# EAGLE schematic Timer Autoradio NE555+CD4011 (EAGLE 6.4)
Circuito per mantenere l'autoradio acceso per ancora 15 minuti dopo aver spento la macchina.
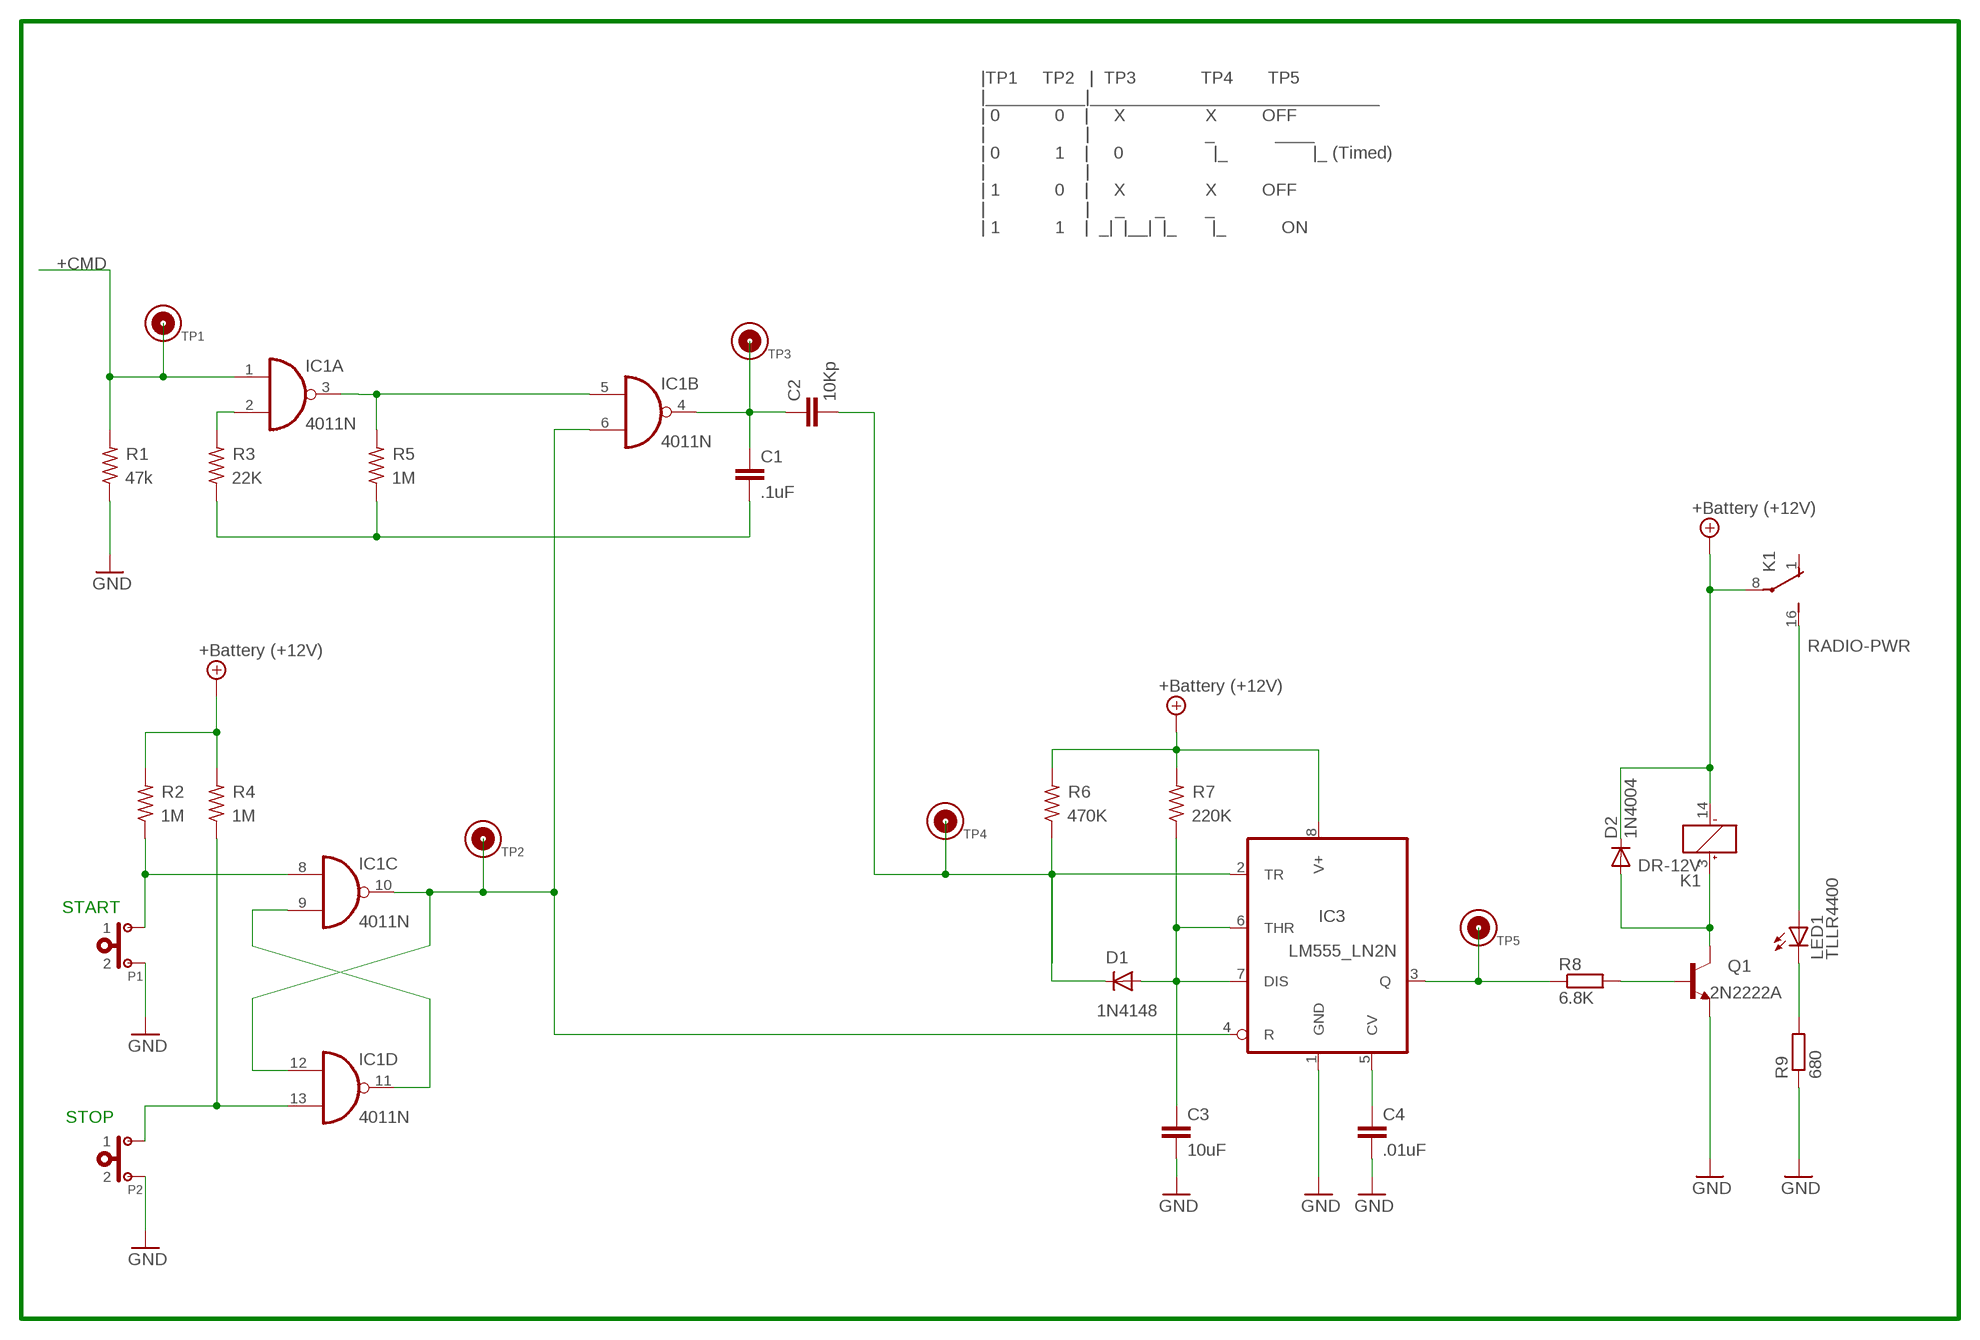
[diagram p0: schematic, sheet 1]

## Parts
C1  .1uF  C-EU025-040X050  [C025-040X050]
C2  10Kp  C-EU025-040X050  [C025-040X050]
C3  10uF  C-EU025-040X050  [C025-040X050]
C4  .01uF  C-EU025-040X050  [C025-040X050]
D1  1N4148  1N4148DO35-10  [DO35-10]
D2  1N4004  [DO41-10]
IC1  4011N  [DIL14]
IC3  LM555_LN2N  [DIL08]
K1  DR-12V  [DR-1]
LED1  TLLR4400  [LED3MM]
P1  PULSANTENO  [SIP02]
P2  PULSANTENO  [SIP02]
Q1  2N2222A  [TO18]
R1  47k  R-US_0207/12  [0207/12]
R2  1M  R-US_0207/12  [0207/12]
R3  22K  R-US_0207/12  [0207/12]
R4  1M  R-US_0207/12  [0207/12]
R5  1M  R-US_0207/12  [0207/12]
R6  470K  R-US_0207/12  [0207/12]
R7  220K  R-US_0207/12  [0207/12]
R8  6.8K  R-EU_0207/10  [0207/10]
R9  680  R-EU_0207/10  [0207/10]
TP1  SIP01  [SIP01]
TP2  SIP01  [SIP01]
TP3  SIP01  [SIP01]
TP4  SIP01  [SIP01]
TP5  SIP01  [SIP01]

## Nets
+12V: D2.C IC3.8(V+) K1.8(-2:P) K1.14(-1:-) R2.2 R4.2 R6.2 R7.2 ; supply symbol labelled +Battery (+12V)
+CMD: IC1.1(A:I0) R1.2 TP1.P$1(TP)
GND: C3.2 C4.2 IC3.1(GND) P1.2 P2.2 Q1.1(E) R1.1 R9.1
N$1: C1.2 R3.1 R5.1
N$2: Q1.2(B) R8.2
N$3: D2.A K1.3(-1:+) Q1.3(C)
N$4: C4.1 IC3.5(CV)
N$5: IC1.3(A:O) IC1.5(B:I0) R5.2
N$6: C1.1 C2.1 IC1.4(B:O) TP3.P$1(TP)
N$7: IC1.2(A:I1) R3.2
N$8: LED1.K(C) R9.2
N$9: IC1.8(C:I0) P1.1 R2.1
N$11: IC3.3(Q) R8.1 TP5.P$1(TP)
N$12: IC1.6(B:I1) IC1.10(C:O) IC1.12(D:I0) IC3.4(R) TP2.P$1(TP)
N$13: IC1.9(C:I1) IC1.11(D:O)
N$14: C2.2 D1.C IC3.2(TR) R6.1 TP4.P$1(TP)
N$15: IC1.13(D:I1) P2.1 R4.1
N$18: C3.1 D1.A IC3.6(THR) IC3.7(DIS) R7.1
RADIO-PWR: K1.16(-2:S) LED1.A
Unconnected: K1.1(-2:O)

## Notes on the sheet
- |TP1     TP2   |  TP3             TP4       TP5
  |__________|_____________________________
  | 0           0    |     X                X         OFF
  |                    |                       _            ____
  | 0           1    |     0                  |_                 |_ (Timed) 
  |                    |
  | 1           0    |     X                X         OFF
  |                    |     _      _        _
  | 1           1    |  _|  |__|  |_       |_           ON
- START
- STOP

## Power pins joined to a net without a drawn wire
VDD: IC1.14(P:VDD)
VSS: IC1.7(P:VSS)

## Library data of the parts
C1-C4 = Ln-RCL:C-EU: CAPACITOR, European symbol
D1 = diode:1N4148: DIODE high speed (Philips)
D2 = diode:1N4004: DIODE general purpose rectifier, 1 A
IC1 = Ln-40xx:4011: Quad 2-input NAND
IC3 = Ln-linear:*555_LN2: TIMER
K1 = relay:DR-*V: HIGHLY RELIABLE MINIATURE DIP RELAYS NAiS Source: www.mew-europe.com/ac/download/ datasheet/relay/dr_en.pdf; MPN: DR-12V; OC_FARNELL: 1124066; OC_NEWARK: 91K6794
LED1 = Loreto:TLLR4400: Low Current (2mA) LED 3 mm Tinted Diffused Package color RED Source: Data sheet <http://www.farnell.com/datasheets/391100.pdf>; MF: VISHAY SEMICONDUCTOR; OC_FARNELL: 1612437
P1 P2 = Ln-Varie:PULSANTENO: Pulsante NO
Q1 = transistor-npn:2N2222*: NPN Transistor
R1-R7 = rcl:R-US_: RESISTOR, American symbol
R8 R9 = rcl:R-EU_: RESISTOR, European symbol
TP1-TP5 = Ln-Varie:SIP01: SIP01 TestPoint